# EasyEDA Pro project salvador.epro, schematic Schematic1
Board Name: Board1; Create Date: 2025-11-28; Page Name: P1; Project Name: fpga; Schematic Name: Schematic1; Update Date: 2025-12-03; Drawn: 2025-11-28; Page Size: A3; Reviewed: 2025-11-30; Version: V1.0
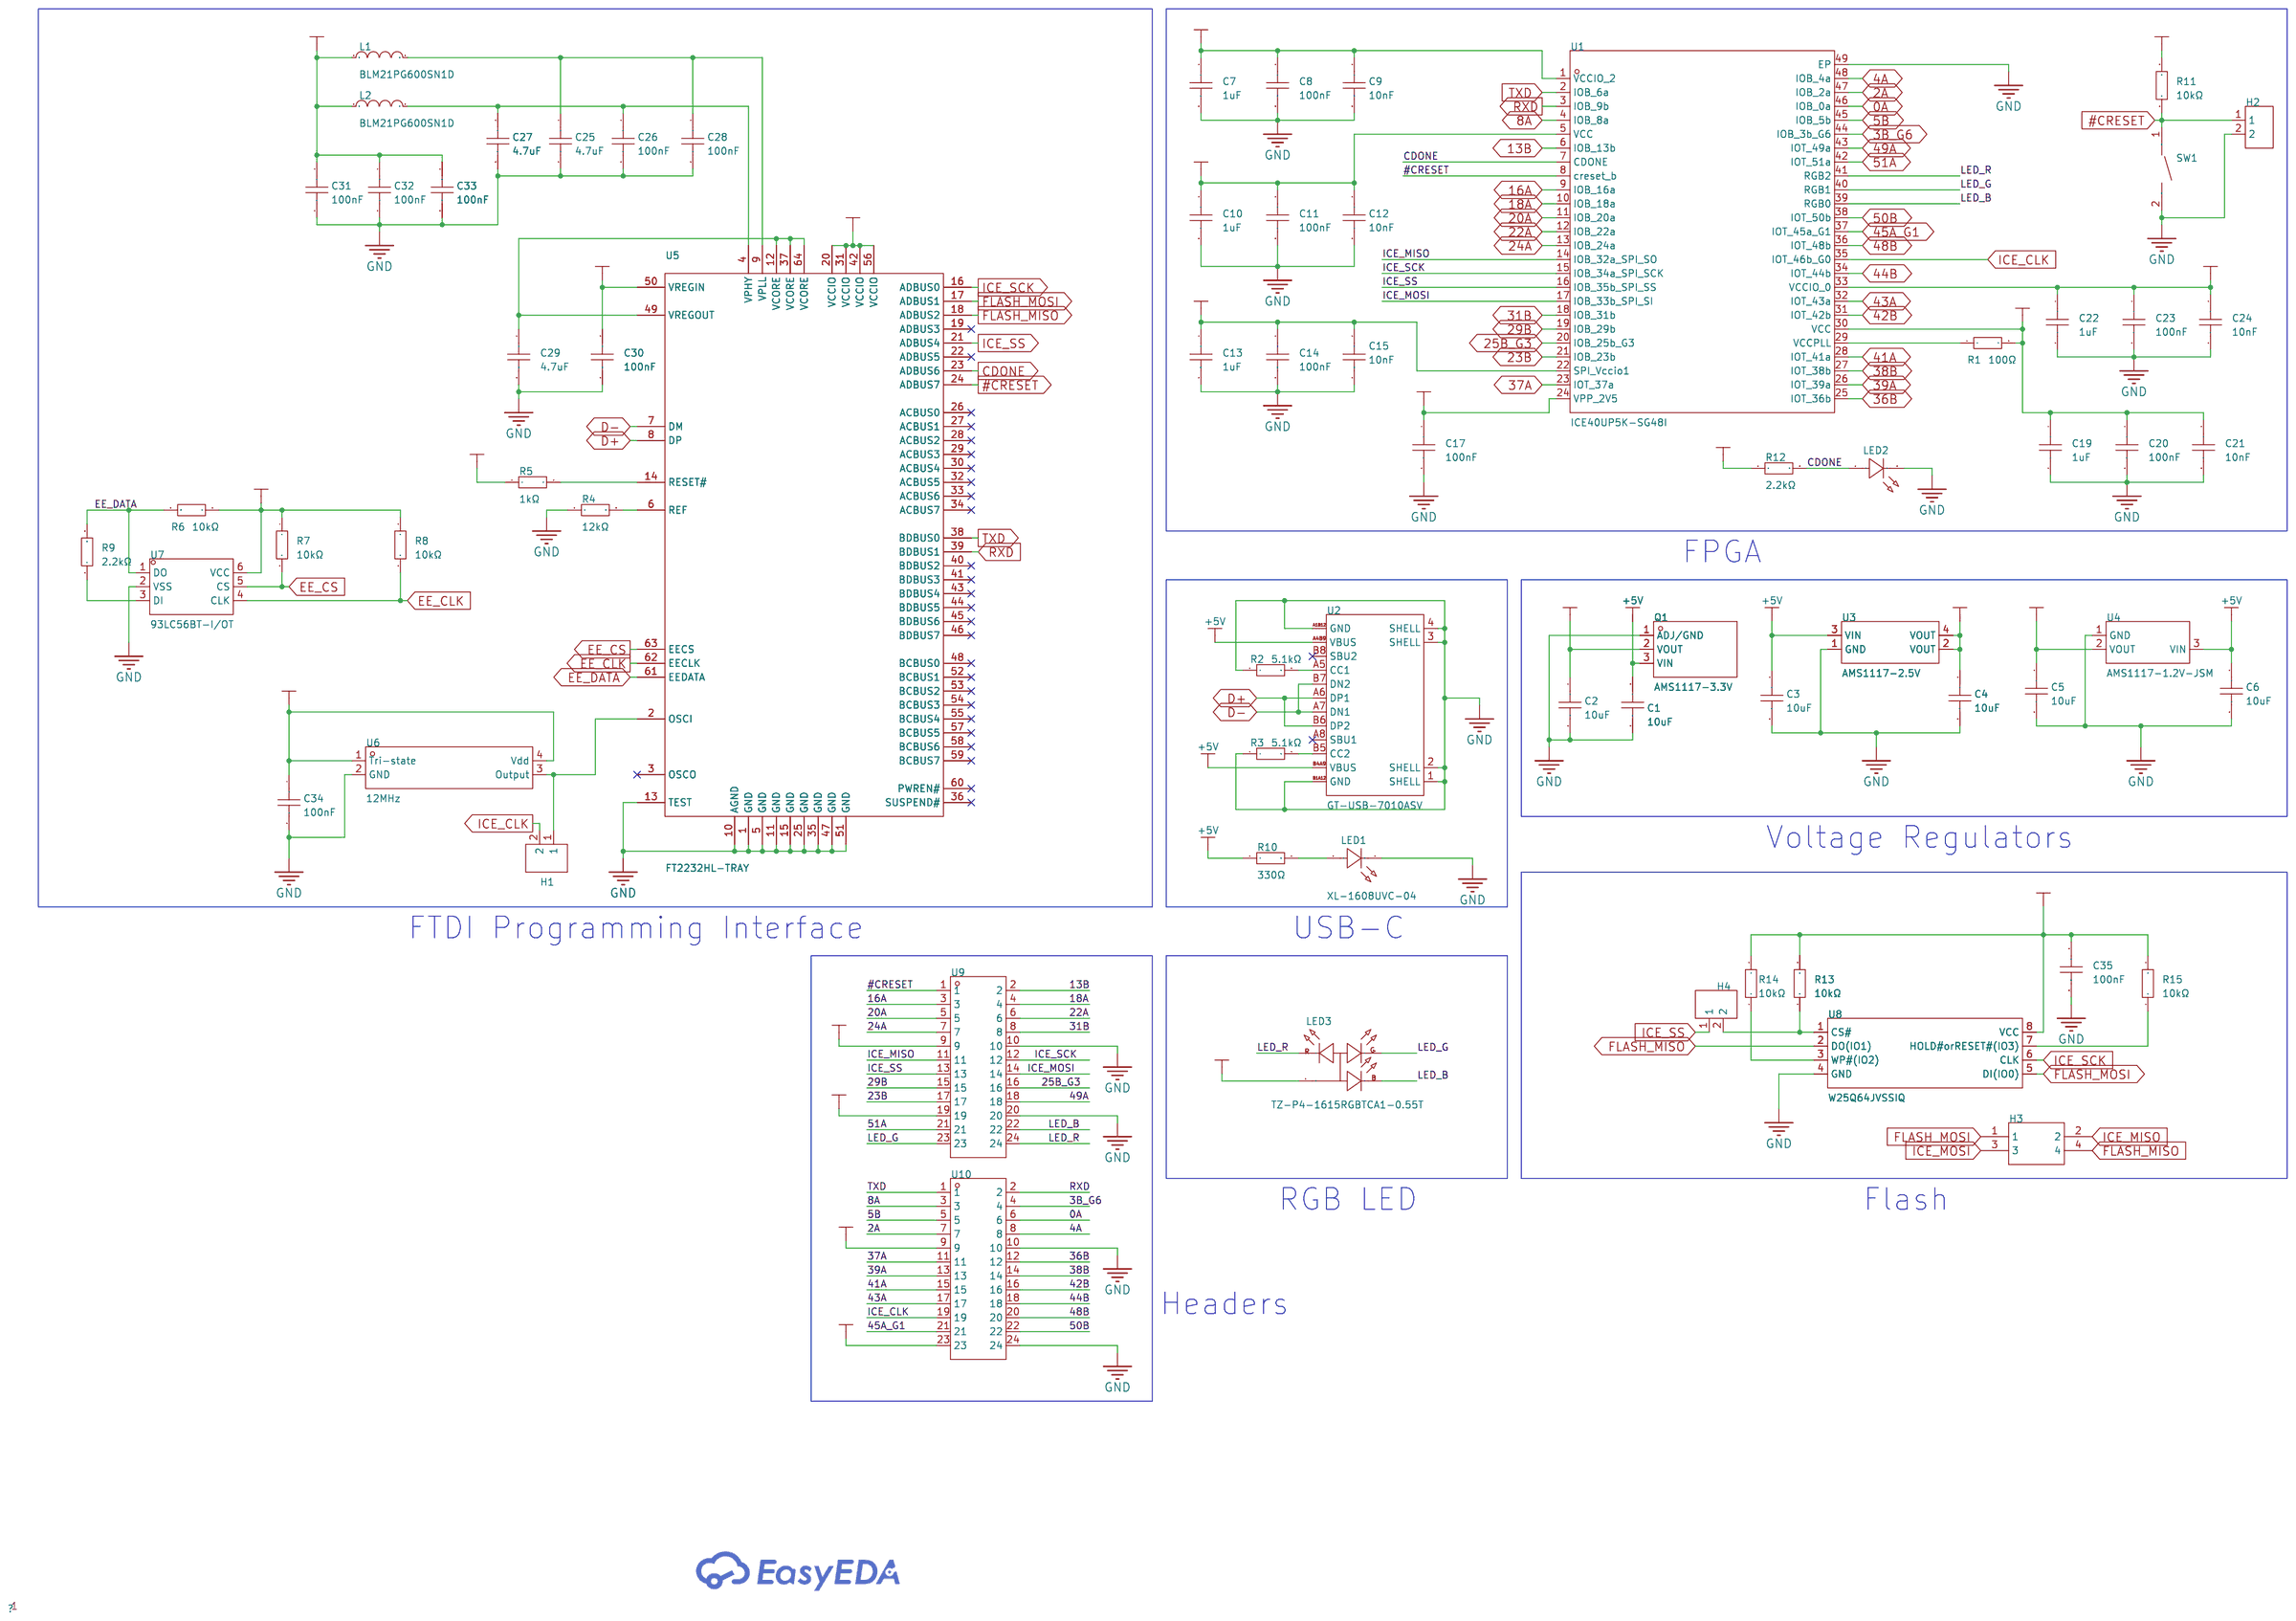
[diagram p0: schematic sheet]

## Parts
C1  10uF  [C0603]
C2  10uF  [C0603]
C3  10uF  [C0603]
C4  10uF  [C0603]
C5  10uF  [C0603]
C6  10uF  [C0603]
C7  1uF  [C0402]
C8  100nF  [C0402]
C9  10nF  [C0402]
C10  1uF  [C0402]
C11  100nF  [C0402]
C12  10nF  [C0402]
C13  1uF  [C0402]
C14  100nF  [C0402]
C15  10nF  [C0402]
C17  100nF  [C0402]
C19  1uF  [C0402]
C20  100nF  [C0402]
C21  10nF  [C0402]
C22  1uF  [C0402]
C23  100nF  [C0402]
C24  10nF  [C0402]
C25  4.7uF  [C0402]
C26  100nF  [C0402]
C27  4.7uF  [C0402]
C28  100nF  [C0402]
C29  4.7uF  [C0402]
C30  100nF  [C0402]
C31  100nF  [C0402]
C32  100nF  [C0402]
C33  100nF  [C0402]
C34  100nF  [C0402]
C35  100nF  [C0402]
H1  PZ254V-11-02P  [HDR-TH_2P-P2.54-V-M]
H2  PZ254V-11-02P  [HDR-TH_2P-P2.54-V-M]
H3  A2541WV-2x2P  [HDR-TH_4P-P2.54-V-R2-C2-S2.54_A2541WV-2X2P]
H4  PZ254V-11-02P  [HDR-TH_2P-P2.54-V-M]
L1  BLM21PG600SN1D  [L0805]
L2  BLM21PG600SN1D  [L0805]
LED1  XL-1608UVC-04  [LED0603-RD_PINK]
LED2  19-219/GHC-YR2T1B5Y/3T  [LED-SMD_L1.6-W0.8_19-219-GHC-YR2T1B5Y-3T]
LED3  TZ-P4-1615RGBTCA1-0.55T  [LED-SMD_4P-L1.6-W1.5-BR_TZ-P4-1615]
Q1  AMS1117-3.3V  [SOT-89-3_L4.5-W2.5-P1.50-LS4.2-BR]
R1  100Ω  [R0402]
R2  5.1kΩ  [R0402]
R3  5.1kΩ  [R0402]
R4  12kΩ  [R0402]
R5  1kΩ  [R0402]
R6  10kΩ  [R0402]
R7  10kΩ  [R0402]
R8  10kΩ  [R0402]
R9  2.2kΩ  [R0402]
R10  330Ω  [R0603]
R11  10kΩ  [R0402]
R12  2.2kΩ  [R0402]
R13  10kΩ  [R0402]
R14  10kΩ  [R0402]
R15  10kΩ  [R0402]
SW1  TS-1088-AR02016  [SW-SMD_L3.9-W3.0-P4.45]
U1  ICE40UP5K-SG48I  [QFN-48_L7.0-W7.0-P0.50-TL-EP5.4-1]
U2  GT-USB-7010ASV  [USB-C-SMD_G-SWITCH_GT-USB-7010ASV]
U3  AMS1117-2.5V  [SOT-89-4_L4.5-W2.5-P1.50-LS4.2-TR]
U4  AMS1117-1.2V-JSM  [SOT-89-3_L4.5-W2.4-P1.50-LS4.0-BR]
U5  FT2232HL-TRAY  [LQFP-64_L10.0-W10.0-P0.50-LS12.0-TL]
U6  12MHz  [OSC-SMD_4P-L2.5-W2.0-BL]
U7  93LC56BT-I/OT  [SOT-23-6_L2.9-W1.6-P0.95-LS2.8-BR]
U8  W25Q64JVSSIQ  [SOIC-8_L5.3-W5.3-P1.27-LS8.0-BL]
U9  2541FV-2x12P  [HDR-TH_24P-P2.54-V-F-R2-C12-S2.54-2]
U10  2541FV-2x12P  [HDR-TH_24P-P2.54-V-F-R2-C12-S2.54-2]

## Library data of the parts
C1-C6 = CL10A106KP8NNNC: Capacitance:10uF Tolerance:±10% Tolerance:±10% Voltage Rating:10V Temperature Coefficient:X5R; LCSC Part Name: 10uF ±10% 10V; Supplier Part: C19702; Manufacturer: SAMSUNG(三星); Supplier Footprint: 0603; JLCPCB Part Class: Basic Part; Datasheet: https://item.szlcsc.com/datasheet/CL10A106KP8NNNC/20411.html; Supplier: LCSC; Tolerance: ±10%; Voltage Rating: 10V; Temperature Coefficient: X5R
C7 C10 C13 C19 C22 = CL05A105KA5NQNC: Capacitance:1uF Tolerance:±10% Tolerance:±10% Voltage Rating:25V Temperature Coefficient:X5R; LCSC Part Name: 1uF ±10% 25V; Supplier Part: C52923; Manufacturer: SAMSUNG(三星); Supplier Footprint: 0402; JLCPCB Part Class: Basic Part; Datasheet: https://item.szlcsc.com/datasheet/CL05A105KA5NQNC/53938.html; Supplier: LCSC; Tolerance: ±10%; Voltage Rating: 25V; Temperature Coefficient: X5R
C8 C11 C14 C17 C20 C23 C26 C28 C30-C35 = CL05B104KO5NNNC: Capacitance:100nF Tolerance:±10% Tolerance:±10% Voltage Rating:16V Temperature Coefficient:X7R; LCSC Part Name: 100nF ±10% 16V; Supplier Part: C1525; Manufacturer: SAMSUNG(三星); Supplier Footprint: 0402; JLCPCB Part Class: Basic Part; Datasheet: https://item.szlcsc.com/datasheet/CL05B104KO5NNNC/1877.html; Supplier: LCSC; Tolerance: ±10%; Voltage Rating: 16V; Temperature Coefficient: X7R
C9 C12 C15 C21 C24 = CL05B103KB5NNNC: Capacitance:10nF Tolerance:±10% Tolerance:±10% Voltage Rating:50V Temperature Coefficient:X7R; LCSC Part Name: 10nF ±10% 50V; Supplier Part: C15195; Manufacturer: SAMSUNG(三星); Supplier Footprint: 0402; JLCPCB Part Class: Basic Part; Datasheet: https://item.szlcsc.com/datasheet/CL05B103KB5NNNC/15869.html; Supplier: LCSC; Tolerance: ±10%; Voltage Rating: 50V; Temperature Coefficient: X7R
C25 C27 C29 = CL05A475MP5NRNC: Capacitance:4.7uF Tolerance:±20% Tolerance:±20% Voltage Rating:10V Temperature Coefficient:X5R; LCSC Part Name: 4.7uF ±20% 10V; Supplier Part: C23733; Manufacturer: SAMSUNG(三星); Supplier Footprint: 0402; JLCPCB Part Class: Basic Part; Datasheet: https://item.szlcsc.com/datasheet/CL05A475MP5NRNC/24469.html; Supplier: LCSC; Tolerance: ±20%; Voltage Rating: 10V; Temperature Coefficient: X5R
H1 H2 H4 = PZ254V-11-02P: Pin Structure:1x2P Pitch:2.54mm Row Spacing:- Circluar Pins/Square Pins:Pin Header Mounting Type:Through Hole Number of Rows:1 Number of Pins:2P Current Rating:- Voltage Rating (Max):- Length of Mating Pin:6mm Insulation Height:2.5mm Length of End Connect; LCSC Part Name: 1x2P 间距:2.54mm 方针 直插; Supplier Part: C492401; Manufacturer: XFCN(兴飞); Supplier Footprint: 插件,P=2.54mm; JLCPCB Part Class: Extended Part; Datasheet: https://item.szlcsc.com/datasheet/PZ254V-11-02P/502957.html; Supplier: LCSC; Pin Structure: 1x2P; Pitch: 2.54mm; Circluar Pins/Square Pins: Pin Header; Mounting Type: Through Hole; Number of Rows: 1; Number of Pins: 2P; Length of Mating Pin: 6mm; Insulation Height: 2.5mm; Length of End Connection Pin: 3mm; Contact Material: Brass; Operating Temperature: -40℃~+105℃; Color: Black
H3 = A2541WV-2x2P: Pin Structure:2x2P Pitch:2.54mm Row Spacing:2.54mm Circluar Pins/Square Pins:Square Pins Mounting Type:Straight Number of Rows:双排 Number of Pins:4P Current Rating (Max):3A Voltage Rating (Max):250V Length of Mating Pin:6mm Insulation Height:2.54mm Length; LCSC Part Name: 2x2P 间距:2.54mm 方针 直插; Supplier Part: C225517; Manufacturer: CJT(长江连接器); Supplier Footprint: 插件,P=2.54mm; JLCPCB Part Class: Extended Part; Datasheet: https://atta.szlcsc.com/upload/public/pdf/source/20180724/C239359_48B1BC0CA1B4E4396A63955AAFD15564.pdf; Supplier: LCSC; Pin Structure: 2x2P; Pitch: 2.54mm; Row Spacing: 2.54mm; Circluar Pins/Square Pins: Square Pins; Mounting Type: Straight; Number of Rows: 双排; Number of Pins: 4P; Current Rating (Max): 3A; Voltage Rating (Max): 250V; Length of Mating Pin: 6mm; Insulation Height: 2.54mm; Length of End Connection Pin: 3mm; Contact Plating: Gold; Operating Temperature Range: -40℃~+105℃; Color: Black
L1 L2 = BLM21PG600SN1D: Impedance @ Frequency:60Ω@100MHz Tolerance:±25% Tolerance:±25% DC Resistance(DCR):20mΩ Current Rating:3.5A Number of Circuits:1; LCSC Part Name: 单路 0805磁珠 阻抗60Ω@100MHz; Supplier Part: C18305; Manufacturer: muRata(村田); Supplier Footprint: 0805; JLCPCB Part Class: Extended Part; Datasheet: https://item.szlcsc.com/datasheet/BLM21PG600SN1D/19000.html; Supplier: LCSC; Impedance @ Frequency: 60Ω@100MHz; Tolerance: ±25%; DC Resistance(DCR): 20mΩ; Current Rating: 3.5A; Number of Circuits: 1
LED1 = XL-1608UVC-04: Lamp Holder Type:- Illumination Color:Purple Voltage - Forward(Vf):3.4V Voltage - Forward(Vf):3.4V Power(Watts):100mW Forward Current:5mA Wavelength - Dominant:- Wavelength - Dominant:- Peak Wavelength:405nm Diode Configuration:- Lens Color:Water Clear Co; LCSC Part Name: 紫色; Supplier Part: C7371898; Manufacturer: XINGLIGHT(成兴光); Supplier Footprint: 0603; JLCPCB Part Class: Extended Part; Datasheet: https://item.szlcsc.com/datasheet/XL-1608UVC-04/8342970.html; Supplier: LCSC; Illumination Color: Purple; Voltage - Forward(Vf): 3.4V; Power(Watts): 100mW; Forward Current: 5mA; Peak Wavelength: 405nm; Lens Color: Water Clear; Luminous Intensity: 60mcd; Viewing Angle: 120°; Mounting Style: op View Mount; Operating Temperature: -40℃~+85℃
LED2 = 19-219/GHC-YR2T1B5Y/3T: Lamp Holder Type:- Illumination Color:Green Voltage - Forward(Vf):- Voltage - Forward(Vf):- Power(Watts):- Forward Current:- Wavelength - Dominant:518nm Wavelength - Dominant:518nm Peak Wavelength:525nm Diode Configuration:- Lens Color:Water Clear Color T; LCSC Part Name: 0603正贴式 绿灯(Iv=140~360mcd) @IF=20mA); Supplier Part: C2994781; Manufacturer: EVERLIGHT(亿光); Supplier Footprint: 0603; JLCPCB Part Class: Extended Part; Datasheet: https://www.everlighteurope.com/custom/files/datasheets/DSE-0006814.pdf; Supplier: LCSC; Illumination Color: Green; Wavelength - Dominant: 518nm; Peak Wavelength: 525nm; Lens Color: Water Clear
LED3 = TZ-P4-1615RGBTCA1-0.55T: Diode Configuration:Common Anode Viewing Angle:120° Lens Color:Water Clear Operating Temperature:-40℃~+80℃ Operating Temperature:-40℃~+80℃; LCSC Part Name: RGB三色; Supplier Part: C779813; Manufacturer: TUOZHAN(拓展光电); Supplier Footprint: SMD-4P,1.6x1.5mm; JLCPCB Part Class: Extended Part; Datasheet: https://item.szlcsc.com/datasheet/TZ-P4-1615RGBTCA1-0.55T/831187.html; Supplier: LCSC; Diode Configuration: Common Anode; Viewing Angle: 120°; Lens Color: Water Clear; Operating Temperature: -40℃~+80℃
Q1 = AMS1117-3.3V_C5120796: Output Type:Fixed Voltage - Supply:18V Output Voltage:3.3V Output Voltage:3.3V Output Current:1A Voltage Dropout:1.4V@(1A) standby current:12mA Operating Temperature:0℃~+125℃ Operating Temperature:0℃~+125℃ Output Configuration:Positive electrode Number of; LCSC Part Name: 输入18V 输出3.3V 1A; Supplier Part: C5120796; Manufacturer: MSKSEMI(美森科); Supplier Footprint: SOT-89; JLCPCB Part Class: Extended Part; Datasheet: https://item.szlcsc.com/datasheet/AMS1117-3.3V/5706251.html; Supplier: LCSC; Output Type: Fixed; Voltage - Supply: 18V; Output Voltage: 3.3V; Output Current: 1A; Voltage Dropout: 1.4V@(1A); standby current: 12mA; Operating Temperature: 0℃~+125℃; Output Configuration: Positive electrode; Number of Outputs: 1
R1 = 0402WGF1000TCE: Type:Thick Film Resistors Resistance: Tolerance:±1% Tolerance:±1% Power(Watts): Overload Voltage (Max): Temperature Coefficient:±200ppm/℃ Temperature Coefficient:±200ppm/℃ Operating Temperature Range:-55℃~+155℃ Operating Temperature Range:-55℃~+155℃; LCSC Part Name: 100Ω ±1% 62.5mW 厚膜电阻; Supplier Part: C25076; Manufacturer: UNI-ROYAL(厚声); Supplier Footprint: 0402; JLCPCB Part Class: Basic Part; Datasheet: https://atta.szlcsc.com/upload/public/pdf/source/20200306/C422600_1E6D84923E4A46A82E41ADD87F860B5C.pdf; Supplier: LCSC; Type: Thick Film Resistors; Tolerance: ±1%; Temperature Coefficient: ±200ppm/℃; Operating Temperature Range: -55℃~+155℃
R2 R3 = 0402WGF5101TCE: Type:Thick Film Resistor Resistance:5.1kΩ Tolerance:±1% Tolerance:±1% Power(Watts):62.5mW Voltage-Supply(Max):50V Temperature Coefficient:±100ppm/℃ Temperature Coefficient:±100ppm/℃ Operating Temperature:-55℃~+155℃ Operating Temperature:-55℃~+155℃; LCSC Part Name: 5.1kΩ ±1% 62.5mW 厚膜电阻; Supplier Part: C25905; Manufacturer: UNI-ROYAL(厚声); Supplier Footprint: 0402; JLCPCB Part Class: Basic Part; Datasheet: https://item.szlcsc.com/datasheet/0402WGF5101TCE/26648.html; Supplier: LCSC; Type: Thick Film Resistor; Tolerance: ±1%; Power(Watts): 62.5mW; Voltage-Supply(Max): 50V; Temperature Coefficient: ±100ppm/℃; Operating Temperature: -55℃~+155℃
R4 = 0402WGF1202TCE: Type:Thick Film Resistor Resistance:12kΩ Tolerance:±1% Tolerance:±1% Power(Watts):62.5mW Voltage-Supply(Max):50V Temperature Coefficient:±100ppm/℃ Temperature Coefficient:±100ppm/℃ Operating Temperature:-55℃~+155℃ Operating Temperature:-55℃~+155℃; LCSC Part Name: 12kΩ ±1% 62.5mW 厚膜电阻; Supplier Part: C25752; Manufacturer: UNI-ROYAL(厚声); Supplier Footprint: 0402; JLCPCB Part Class: Basic Part; Datasheet: https://item.szlcsc.com/datasheet/0402WGF1202TCE/26495.html; Supplier: LCSC; Type: Thick Film Resistor; Tolerance: ±1%; Power(Watts): 62.5mW; Voltage-Supply(Max): 50V; Temperature Coefficient: ±100ppm/℃; Operating Temperature: -55℃~+155℃
R5 = 0402WGF1001TCE: Type:Thick Film Resistor Resistance:1kΩ Tolerance:±1% Tolerance:±1% Power(Watts):62.5mW Voltage-Supply(Max):50V Temperature Coefficient:±100ppm/℃ Temperature Coefficient:±100ppm/℃ Operating Temperature:-55℃~+155℃ Operating Temperature:-55℃~+155℃; LCSC Part Name: 1kΩ ±1% 62.5mW 厚膜电阻; Supplier Part: C11702; Manufacturer: UNI-ROYAL(厚声); Supplier Footprint: 0402; JLCPCB Part Class: Basic Part; Datasheet: https://item.szlcsc.com/datasheet/0402WGF1001TCE/12256.html; Supplier: LCSC; Type: Thick Film Resistor; Tolerance: ±1%; Power(Watts): 62.5mW; Voltage-Supply(Max): 50V; Temperature Coefficient: ±100ppm/℃; Operating Temperature: -55℃~+155℃
R6-R8 R11 R13-R15 = 0402WGF1002TCE: Type:Thick Film Resistor Resistance:10kΩ Tolerance:±1% Tolerance:±1% Power(Watts):62.5mW Voltage-Supply(Max):50V Temperature Coefficient:±100ppm/℃ Temperature Coefficient:±100ppm/℃ Operating Temperature:-55℃~+155℃ Operating Temperature:-55℃~+155℃; LCSC Part Name: 10kΩ ±1% 62.5mW 厚膜电阻; Supplier Part: C25744; Manufacturer: UNI-ROYAL(厚声); Supplier Footprint: 0402; JLCPCB Part Class: Basic Part; Datasheet: https://item.szlcsc.com/datasheet/0402WGF1002TCE/26487.html; Supplier: LCSC; Type: Thick Film Resistor; Tolerance: ±1%; Power(Watts): 62.5mW; Voltage-Supply(Max): 50V; Temperature Coefficient: ±100ppm/℃; Operating Temperature: -55℃~+155℃
R9 R12 = 0402WGF2201TCE: Type:Thick Film Resistor Resistance:2.2kΩ Tolerance:±1% Tolerance:±1% Power(Watts):62.5mW Voltage-Supply(Max):50V Temperature Coefficient:±100ppm/℃ Temperature Coefficient:±100ppm/℃ Operating Temperature:-55℃~+155℃ Operating Temperature:-55℃~+155℃; LCSC Part Name: 2.2kΩ ±1% 62.5mW 厚膜电阻; Supplier Part: C25879; Manufacturer: UNI-ROYAL(厚声); Supplier Footprint: 0402; JLCPCB Part Class: Basic Part; Datasheet: https://item.szlcsc.com/datasheet/0402WGF2201TCE/26622.html; Supplier: LCSC; Type: Thick Film Resistor; Tolerance: ±1%; Power(Watts): 62.5mW; Voltage-Supply(Max): 50V; Temperature Coefficient: ±100ppm/℃; Operating Temperature: -55℃~+155℃
R10 = 0603WAF3300T5E: Type:Thick Film Resistors Resistance: Tolerance:±1% Tolerance:±1% Power(Watts): Overload Voltage (Max): Temperature Coefficient:±100ppm/℃ Temperature Coefficient:±100ppm/℃ Operating Temperature Range:-55℃~+155℃ Operating Temperature Range:-55℃~+155℃; LCSC Part Name: 330Ω ±1% 100mW 厚膜电阻; Supplier Part: C23138; Manufacturer: UNI-ROYAL(厚声); Supplier Footprint: 0603; JLCPCB Part Class: Basic Part; Datasheet: https://atta.szlcsc.com/upload/public/pdf/source/20200306/C422600_1E6D84923E4A46A82E41ADD87F860B5C.pdf; Supplier: LCSC; Type: Thick Film Resistors; Tolerance: ±1%; Temperature Coefficient: ±100ppm/℃; Operating Temperature Range: -55℃~+155℃
SW1 = TS-1088-AR02016: Circuit:SPST Actuator Style:Round Button Operating Force:1.6N Mounting Type:Surface Mount,Vertical Length:4mm Width:3mm Switch Height:2mm with Bracket:Without Bracket Contact Current:50mA Voltage Rating:12V Actuator/Cap Color:Black Termination Style:SMD(S; LCSC Part Name: 4*3*2mm 立贴 轻触开关; Supplier Part: C720477; Manufacturer: XUNPU(讯普); Supplier Footprint: SMD,4x3mm; JLCPCB Part Class: Basic Part; Datasheet: https://item.szlcsc.com/datasheet/TS-1088-AR02016/763484.html; Supplier: LCSC; Circuit: SPST; Actuator Style: Round Button; Operating Force: 1.6N; Mounting Type: Surface Mount,Vertical; Length: 4mm; Width: 3mm; Switch Height: 2mm; with Bracket: Without Bracket; Contact Current: 50mA; Voltage Rating: 12V; Actuator/Cap Color: Black; Termination Style: SMD(SMT) Tab; Life: 100,000 Cycles; Operating Temperature: -30℃~+80℃
U1 = ICE40UP5K-SG48I: Type:- Supply Voltage Range - VCCIO:- Supply Voltage Range - VCCIO:- Logic Elements / Cells:5280 Logic Array Blocks:660 Embedded Block RAM:1171456bit Operating Temperature Range:-40℃~+100℃ Operating Temperature Range:-40℃~+100℃; LCSC Part Name: ICE40UP5K SG48I; Supplier Part: C2678152; Manufacturer: LATTICE(莱迪思); Supplier Footprint: QFN-48-EP(7x7); JLCPCB Part Class: Extended Part; Datasheet: https://atta.szlcsc.com/upload/public/pdf/source/20210913/C2889329_82E663D90B49CAF53877542F8A43E4F7.pdf; Supplier: LCSC; Logic Elements / Cells: 5280; Logic Array Blocks: 660; Embedded Block RAM: 1171456bit; Operating Temperature Range: -40℃~+100℃
U2 = GT-USB-7010ASV: Connector Type:Type-C Standard:USB 2.0 Gender:Female Mounting Style:Horizontal attachment Number of Contacts:16P Number of Ports:1 Current Rating - Power (Max):3A Rated Voltage (Max):24V Connect-Disconnect Life:10,000 times Center Height:1.68mm Length:7.3; LCSC Part Name: Type-C 母 卧贴; Supplier Part: C2988369; Manufacturer: G-Switch(品赞); Supplier Footprint: SMD; JLCPCB Part Class: Extended Part; Datasheet: https://atta.szlcsc.com/upload/public/pdf/source/20230327/DF227B64686AC8FA0AD1775797F2C3F1.pdf; Supplier: LCSC; Connector Type: Type-C; Standard: USB 2.0; Gender: Female; Mounting Style: Horizontal attachment; Number of Contacts: 16P; Number of Ports: 1; Current Rating - Power (Max): 3A; Rated Voltage (Max): 24V; Connect-Disconnect Life: 10,000 times; Center Height: 1.68mm; Length: 7.35mm; Core Colour: Black; Operating Temperature Range: -40℃~+85℃
U3 = AMS1117-2.5V_C5240694: Output Type:Fixed Voltage - Supply:15V Output Voltage:2.5V Output Voltage:2.5V Output Current:1A Power Supply Rejection Ratio (PSRR):- Voltage Dropout:18mV@(1A) standby current:12mA Features:Over Temperature Protection Operating Temperature:0℃~+125℃@(Ta); LCSC Part Name: 低压差三端稳压器; Supplier Part: C5240694; Manufacturer: MSKSEMI(美森科); Supplier Footprint: SOT-89; JLCPCB Part Class: Extended Part; Datasheet: https://item.szlcsc.com/datasheet/AMS1117-2.5V/5945871.html; Supplier: LCSC; Output Type: Fixed; Voltage - Supply: 15V; Output Voltage: 2.5V; Output Current: 1A; Voltage Dropout: 18mV@(1A); standby current: 12mA; Features: Over Temperature Protection; Operating Temperature: 0℃~+125℃@(Ta); Output Configuration: Positive; Number of Outputs: 1
U4 = AMS1117-1.2V-JSM: Output Type:Fixed Voltage - Supply:15V Output Voltage:1.2V Output Voltage:1.2V Output Current:1.2A Voltage Dropout:1.3V@(800mA) standby current:2mA Features:Thermal Shutdown Operating Temperature:-20℃~+85℃@(Ta) Operating Temperature:-20℃~+85℃@(Ta) Output; LCSC Part Name: 800mA双极线性稳压器; Supplier Part: C41361593; Manufacturer: JSMSEMI(杰盛微); Supplier Footprint: SOT-89; JLCPCB Part Class: Extended Part; Datasheet: https://item.szlcsc.com/datasheet/AMS1117-1.2V-JSM/43106450.html; Supplier: LCSC; Output Type: Fixed; Voltage - Supply: 15V; Output Voltage: 1.2V; Output Current: 1.2A; Voltage Dropout: 1.3V@(800mA); standby current: 2mA; Features: Thermal Shutdown; Operating Temperature: -20℃~+85℃@(Ta); Output Configuration: Positive; Number of Outputs: 1
U5 = FT2232HL-TRAY: Applications Function:USB to UART；USB to FIFO Protocol: Supply Voltage:3V~3.6V Supply Voltage:3V~3.6V Operating Temperature:-40℃~+85℃ Operating Temperature:-40℃~+85℃; LCSC Part Name: FT2232H双高速USB至多用途UART/FIFO IC; Supplier Part: C1521564; Manufacturer: FTDI(飞特帝亚); Supplier Footprint: LQFP-64(10x10); JLCPCB Part Class: Extended Part; Datasheet: https://atta.szlcsc.com/upload/public/pdf/source/20210427/B16A02D420F6E3983ECDEB507EB20151.pdf; Supplier: LCSC; Applications Function: USB to UART；USB to FIFO; Supply Voltage: 3V~3.6V; Operating Temperature: -40℃~+85℃
U6 = ASTX-H12-12.000MHZ-I25-T: Frequency:12MHz Frequency Stability:±2.5ppm Frequency Stability:±2.5ppm Output Type:HCMOS Operating Temperature:-40℃~+85℃ Operating Temperature:-40℃~+85℃; LCSC Part Name: 12MHz ±2.5ppm; Supplier Part: C51026228; Manufacturer: MSTM; Manufacturer Part: MSTM MST8011AI-12-33E12.000000; Supplier Footprint: SMD2520-4P; JLCPCB Part Class: Extended Part; Datasheet: https://item.szlcsc.com/datasheet/ASTX-H12-12.000MHZ-I25-T/2099273.html; Supplier: LCSC; Frequency Stability: ±2.5ppm; Output Type: HCMOS; Operating Temperature: -40℃~+85℃
U7 = 93LC56BT-I/OT: Interface Type:SPI Memory Size:2Kbit Supply Voltage:2.5V~5.5V Supply Voltage:2.5V~5.5V Write Cycle Time (Tw):6ms Data Retention - TDR (Year):200 years Write Cycle Endurance:1,000,000 Times Operating Temperature:-40℃~+85℃ Operating Temperature:-40℃~+85℃; Supplier Part: C190271; Manufacturer: MICROCHIP(美国微芯); Supplier Footprint: SOT-23-6; JLCPCB Part Class: Extended Part; Datasheet: https://atta.szlcsc.com/upload/public/pdf/source/20140724/1457707164359.pdf; Supplier: LCSC; Interface Type: SPI; Memory Size: 2Kbit; Supply Voltage: 2.5V~5.5V; Write Cycle Time (Tw): 6ms; Data Retention - TDR (Year): 200 years; Write Cycle Endurance: 1,000,000 Times; Operating Temperature: -40℃~+85℃
U8 = W25Q64JVSSIQ_C179171: Interface:SPI Memory Size:64Mbit Clock Frequency:133MHz Voltage - Supply:2.7V~3.6V Voltage - Supply:2.7V~3.6V Program / Erase Cycles:100,000 Cycles Page Programming Time (Tpp):3ms Block Erase Time(tBE):150ms@(64KB) Data Retention - TDR (Year):20 Years Ope; LCSC Part Name: 支持双线、四线SPI接口的3V 64Mbit 串行闪存; Supplier Part: C179171; Manufacturer: Winbond(华邦); Supplier Footprint: SOIC-8-208mil; JLCPCB Part Class: Extended Part; Datasheet: https://item.szlcsc.com/datasheet/W25Q64JVSSIQ/190565.html; Supplier: LCSC; Interface: SPI; Memory Size: 64Mbit; Clock Frequency: 133MHz; Voltage - Supply: 2.7V~3.6V; Program / Erase Cycles: 100,000 Cycles; Page Programming Time (Tpp): 3ms; Block Erase Time(tBE): 150ms@(64KB); Data Retention - TDR (Year): 20 Years
U9 U10 = 2541FV-2x12P: Holes Structure:2x12P Pitch:2.54mm Row Spacing:2.54mm Circular Hole / Square Hole:Square Hole Mounting Type:Through Hole Number of Rows:2 Number of Positions:24P Current Rating:3A Voltage Rating (Max):- Holes Direction:Top Operating Temperature:-40℃~+105℃; LCSC Part Name: 2x12P 间距:2.54mm 直插; Supplier Part: C18722937; Manufacturer: HanElectricity(瀚源); Supplier Footprint: 插件,P=2.54mm; JLCPCB Part Class: Extended Part; Datasheet: https://item.szlcsc.com/datasheet/2541FV-2x12P/19915375.html; Supplier: LCSC; Holes Structure: 2x12P; Pitch: 2.54mm; Row Spacing: 2.54mm; Circular Hole / Square Hole: Square Hole; Mounting Type: Through Hole; Number of Rows: 2; Number of Positions: 24P; Current Rating: 3A; Holes Direction: Top; Operating Temperature: -40℃~+105℃

## Nets
+1V2: C5.1 C10.1 C11.1 C12.1 C19.1 C20.1 C21.1 R1.2 U1.5(VCC) U1.30(VCC) U4.2(VOUT)
+2V5: C4.1 C17.1 U1.24(VPP_2V5) U3.2(VOUT) U3.4(VOUT)
+3V3: C2.1 C7.1 C8.1 C9.1 C13.1 C14.1 C15.1 C22.1 C23.1 C24.1 C30.1 C31.1 C32.1 C33.1 C34.1 C35.1 L1.1 L2.1 LED3.1(COM+) Q1.2(VOUT) R5.1 R6.1 R7.1 R8.1 R11.2 R12.1 R13.2 R14.2 R15.2 U1.1(VCCIO_2) U1.22(SPI_Vccio1) U1.33(VCCIO_0) U5.20(VCCIO) U5.31(VCCIO) U5.42(VCCIO) U5.50(VREGIN) U5.56(VCCIO) U6.1(Tri-state) U6.4(Vdd) U7.6(VCC) U8.8(VCC) U9.9 U9.19 U10.9 U10.23
+5V: C1.1 C3.1 C6.1 Q1.3(VIN) R10.1 U2.A4B9(VBUS) U2.B4A9(VBUS) U3.3(VIN) U4.3(VIN)
GND: C1.2 C2.2 C3.2 C4.2 C5.2 C6.2 C7.2 C8.2 C9.2 C10.2 C11.2 C12.2 C13.2 C14.2 C15.2 C17.2 C19.2 C20.2 C21.2 C22.2 C23.2 C24.2 C25.2 C26.2 C27.2 C28.2 C29.2 C30.2 C31.2 C32.2 C33.2 C34.2 C35.2 H2.2 LED1.1(K) LED2.2(K) Q1.1(ADJ/GND) R2.1 R3.1 R4.1 SW1.2 U1.49(EP) U2.1(SHELL) U2.2(SHELL) U2.3(SHELL) U2.4(SHELL) U2.A1B12(GND) U2.B1A12(GND) U3.1(GND) U4.1(GND) U5.1(GND) U5.5(GND) U5.10(AGND) U5.11(GND) U5.13(TEST) U5.15(GND) U5.25(GND) U5.35(GND) U5.47(GND) U5.51(GND) U6.2(GND) U7.2(VSS) U8.4(GND) U9.10 U9.20 U10.10 U10.24
0A: U1.46(IOB_0a) U10.6
2A: U1.47(IOB_2a) U10.7
3B_G6: U1.44(IOB_3b_G6) U10.4
4A: U1.48(IOB_4a) U10.8
5B: U1.45(IOB_5b) U10.5
8A: U1.4(IOB_8a) U10.3
13B: U1.6(IOB_13b) U9.2
16A: U1.9(IOB_16a) U9.3
18A: U1.10(IOB_18a) U9.4
20A: U1.11(IOB_20a) U9.5
22A: U1.12(IOB_22a) U9.6
23B: U1.21(IOB_23b) U9.17
24A: U1.13(IOB_24a) U9.7
25B_G3: U1.20(IOB_25b_G3) U9.16
29B: U1.19(IOB_29b) U9.15
31B: U1.18(IOB_31b) U9.8
36B: U1.25(IOT_36b) U10.12
37A: U1.23(IOT_37a) U10.11
38B: U1.27(IOT_38b) U10.14
39A: U1.26(IOT_39a) U10.13
41A: U1.28(IOT_41a) U10.15
42B: U1.31(IOT_42b) U10.16
43A: U1.32(IOT_43a) U10.17
44B: U1.34(IOT_44b) U10.18
45A_G1: U1.37(IOT_45a_G1) U10.21
48B: U1.36(IOT_48b) U10.20
49A: U1.43(IOT_49a) U9.18
50B: U1.38(IOT_50b) U10.22
51A: U1.42(IOT_51a) U9.21
#CRESET: H2.1 R11.1 SW1.1 U1.8(creset_b) U5.24(ADBUS7) U9.1
CDONE: LED2.1(A) R12.2 U1.7(CDONE) U5.23(ADBUS6)
D+: U2.A6(DP1) U2.B6(DP2) U5.8(DP)
D-: U2.A7(DN1) U2.B7(DN2) U5.7(DM)
EE_CLK: R8.2 U5.62(EECLK) U7.4(CLK)
EE_CS: R7.2 U5.63(EECS) U7.5(CS)
EE_DATA: R6.2 R9.2 U5.61(EEDATA) U7.1(DO)
FLASH_MISO: H3.4 U5.18(ADBUS2) U8.2(DO(IO1))
FLASH_MOSI: H3.1 U5.17(ADBUS1) U8.5(DI(IO0))
ICE_CLK: H1.2 U1.35(IOT_46b_G0) U10.19
ICE_MISO: H3.2 U1.14(IOB_32a_SPI_SO) U9.11
ICE_MOSI: H3.3 U1.17(IOB_33b_SPI_SI) U9.14
ICE_SCK: U1.15(IOB_34a_SPI_SCK) U5.16(ADBUS0) U8.6(CLK) U9.12
ICE_SS: H4.1 U1.16(IOB_35b_SPI_SS) U5.21(ADBUS4) U9.13
LED_B: LED3.4(-) U1.39(RGB0) U9.22
LED_G: LED3.3(-) U1.40(RGB1) U9.23
LED_R: LED3.2(-) U1.41(RGB2) U9.24
RXD: U1.3(IOB_9b) U5.39(BDBUS1) U10.2
TXD: U1.2(IOB_6a) U5.38(BDBUS0) U10.1
$1N810: R1.1 U1.29(VCCPLL)
$1N2515: R2.2 U2.A5(CC1)
$1N2572: R3.2 U2.B5(CC2)
$1N8265: R4.2 U5.6(REF)
$1N8293: R5.2 U5.14(RESET#)
$1N8446: C29.1 U5.12(VCORE) U5.37(VCORE) U5.49(VREGOUT) U5.64(VCORE)
$1N8806: C26.1 C27.1 L2.2 U5.4(VPHY)
$1N8835: C25.1 C28.1 L1.2 U5.9(VPLL)
$1N13148: H1.1 U5.2(OSCI) U6.3(Output)
$1N13558: R9.1 U7.3(DI)
$1N14034: LED1.2(A) R10.2
$1N15251: R14.1 U8.3(WP#(IO2))
$1N15327: R15.1 U8.7(HOLD#orRESET#(IO3))
$1N15539: H4.2 R13.1 U8.1(CS#)

Not connected (* = marked no-connect by the designer): U2 A8(SBU1)* B8(SBU2)*; U5 3(OSCO)* 19(ADBUS3)* 22(ADBUS5)* 26(ACBUS0)* 27(ACBUS1)* 28(ACBUS2)* 29(ACBUS3)* 30(ACBUS4)* 32(ACBUS5)* 33(ACBUS6)* 34(ACBUS7)* 36(SUSPEND#)* 40(BDBUS2)* 41(BDBUS3)* 43(BDBUS4)* 44(BDBUS5)* 45(BDBUS6)* 46(BDBUS7)* 48(BCBUS0)* 52(BCBUS1)* 53(BCBUS2)* 54(BCBUS3)* 55(BCBUS4)* 57(BCBUS5)* 58(BCBUS6)* 59(BCBUS7)* 60(PWREN#)*

## Notes on the sheet
- FPGA
- Voltage Regulators
- FTDI Programming Interface
- USB-C
- RGB LED
- Flash
- Headers
